# Altium schematic sheet LevelShifter.SchDoc
size A; SheetNumber: 4; SheetTotal: 6
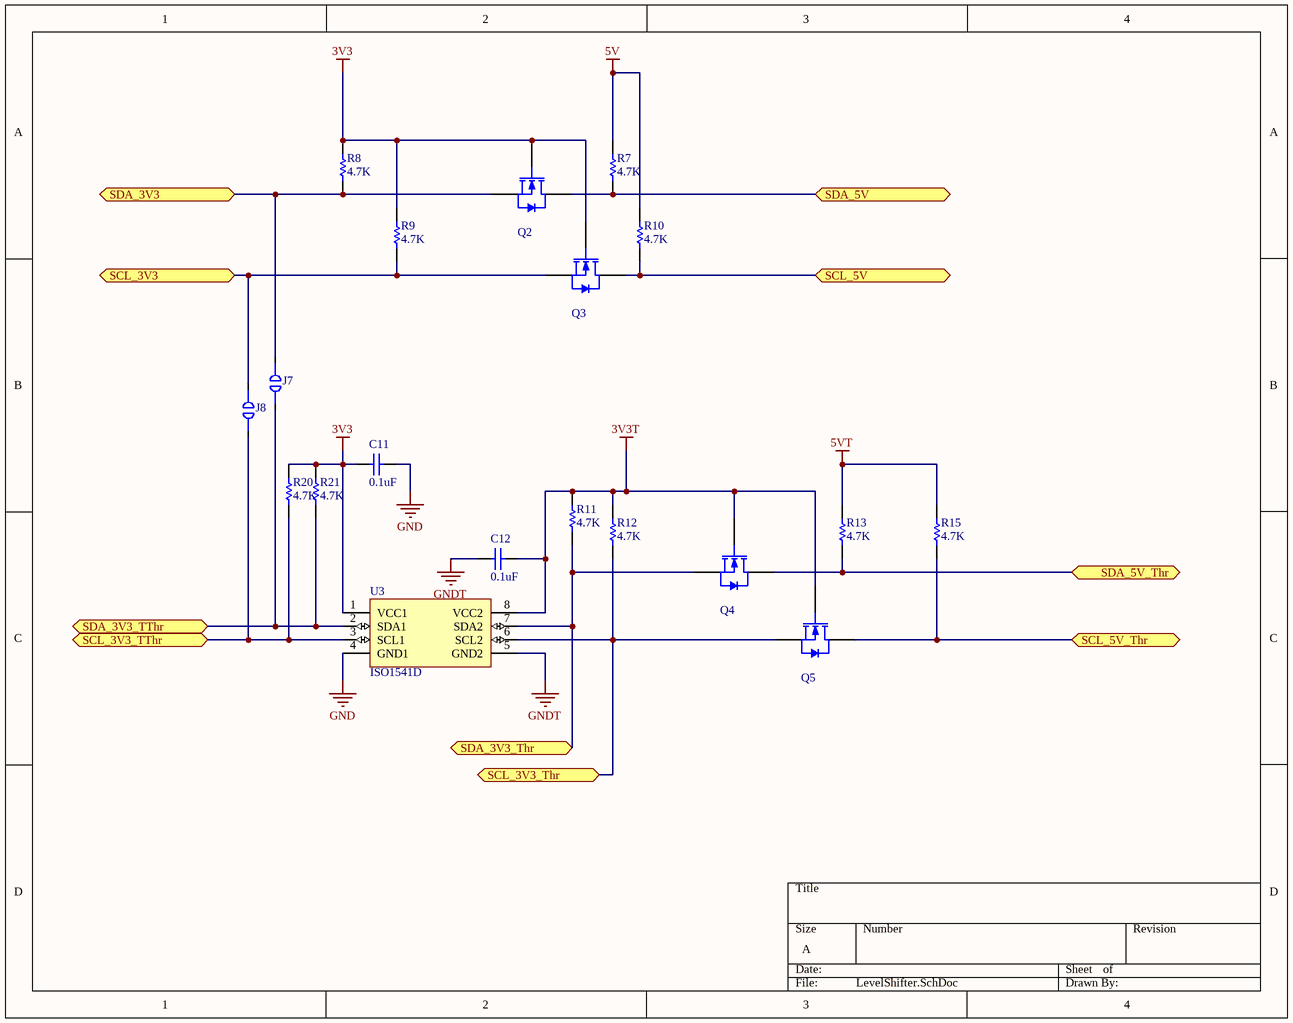
[diagram p0: LevelShifter.SchDoc]

## Parts
C11  0.1uF  [CAPC1608X97X38NL12T08]
C12  0.1uF  [CAPC1608X97X38NL12T08]
J7  Solder Jumper  [SolderJumper]  (value not drawn)
J8  Solder Jumper  [SolderJumper]  (value not drawn)
Q2  MOSFET N-CH  [ONSC-SOT-23-3-318-08_V]  (value not drawn)
Q3  MOSFET N-CH  [ONSC-SOT-23-3-318-08_V]  (value not drawn)
Q4  MOSFET N-CH  [ONSC-SOT-23-3-318-08_V]  (value not drawn)
Q5  MOSFET N-CH  [ONSC-SOT-23-3-318-08_V]  (value not drawn)
R7  4.7K  [RESC1609X55X30NL10T20]
R8  4.7K  [RESC1609X55X30NL10T20]
R9  4.7K  [RESC1609X55X30NL10T20]
R10  4.7K  [RESC1609X55X30NL10T20]
R11  4.7K  [RESC1609X55X30NL10T20]
R12  4.7K  [RESC1609X55X30NL10T20]
R13  4.7K  [RESC1609X55X30NL10T20]
R15  4.7K  [RESC1609X55X30NL10T20]
R20  4.7K  [RESC1609X55X30NL10T20]
R21  4.7K  [RESC1609X55X30NL10T20]
U3  ISO1541D  [ISO1541D]

## Ports
SCL_3V3 (bidir), SCL_3V3_Thr (bidir), SCL_3V3_TThr (bidir), SCL_5V (bidir), SCL_5V_Thr (bidir), SDA_3V3 (bidir), SDA_3V3_Thr (bidir), SDA_3V3_TThr (bidir), SDA_5V (bidir), SDA_5V_Thr (bidir)

## Nets
3V3: C11.2 Q2.1(G) Q3.1(G) R8.2 R9.2 R20.2 R21.2 U3.1(VCC1)
3V3T: C12.1 Q4.1(G) Q5.1(G) R11.2 R12.2 U3.8(VCC2)
5V: R7.2 R10.2
5VT: R13.2 R15.2
GND: C11.1 U3.4(GND1)
GNDT: C12.2 U3.5(GND2)
SCL_3V3: J8.2 Q3.2(S) R9.1 ; port SCL_3V3
SCL_3V3_Thr: Q5.2(S) R12.1 U3.6(SCL2) ; port SCL_3V3_Thr
SCL_3V3_TThr: J8.1 R20.1 U3.3(SCL1) ; port SCL_3V3_TThr
SCL_5V: Q3.3(D) R10.1 ; port SCL_5V
SCL_5V_Thr: Q5.3(D) R15.1 ; port SCL_5V_Thr
SDA_3V3: J7.2 Q2.2(S) R8.1 ; port SDA_3V3
SDA_3V3_Thr: Q4.2(S) R11.1 U3.7(SDA2) ; port SDA_3V3_Thr
SDA_3V3_TThr: J7.1 R21.1 U3.2(SDA1) ; port SDA_3V3_TThr
SDA_5V: Q2.3(D) R7.1 ; port SDA_5V
SDA_5V_Thr: Q4.3(D) R13.1 ; port SDA_5V_Thr

## Library data of the parts
C11 C12 = VJ0603Y104KXXAC: CAP CER 0.1UF 25V X7R 0603; Manufacturer: Vitramon; Part Number: VJ0603Y-104KXXAC; Supplier 1: Digi-Key; Supplier Part Number 1: 720-1378-1-ND
J7 J8 = Solder Jumper: Simple Jumper
Q2-Q5 = BSS138LT1G: MOSFET N-CH 50V 200MA SOT-23; Manufacturer 1: ON Semiconductor; Rds On Max: 3.5R; Max Power Dissipation: 225mW; Input Capacitance: 50pF; Turn-Off Delay Time: 20ns; Gate to Source Voltage (Vgs): 20V; Number of Elements: 1; Element Configuration: Single; Threshold Voltage: 1.5V; Supplier 1: Digi-Key; Supplier Part Number 1: BSS138LT1GOSCT-ND; Manufacturer Part Number 1: BSS138LT1G; Stock 1: 952638; Pricing 1: 1=0.26000, 10=0.21100, 100=0.11210, 500=0.07376, 1000=0.05016 (USD); RoHS: Yes; Case/Package: SOT-23-3; Number of Pins: 3; Contact Plating: Tin,Matte; Min Operating Temperature: -55°C; Max Operating Temperature: 150°C; Packaging: Tape and Reel; Continuous Drain Current (ID): 200mA; Drain to Source Resistance: 3.5R; Package Quantity: 1; Drain to Source Breakdown Voltage: 50V; Power Dissipation: 225mW; Turn-On Delay Time: 20ns; Nominal Vgs: 1.5V; Voltage Rating (DC): 50V; Current Rating: 200mA; On-State Resistance: 3.5R; Length: 3.04mm; Height: 1.01mm; Width: 1.4mm; Radiation Hardening: No; Lead Free: Lead Free; REACH SVHC: No SVHC; Halogen Free: Halogen Free; ComponentLink1URL: https://datasheet.ciiva.com/22641/1596366-22641636.pdf?src-supplier=Element14; ComponentLink1Description: https://datasheet.ciiva.com/22641/1596366-22641636.pdf?src-supplier=Element14; ComponentLink2URL: https://datasheet.ciiva.com/936/bss138lt1-d-936801.pdf?src-supplier=Digi-Key; ComponentLink2Description: https://datasheet.ciiva.com/936/bss138lt1-d-936801.pdf?src-supplier=Digi-Key; ComponentLink3URL: https://datasheet.ciiva.com/936/bss138lt1-d-936802.pdf?src-supplier=Digi-Key; ComponentLink3Description: https://datasheet.ciiva.com/936/bss138lt1-d-936802.pdf?src-supplier=Digi-Key; ComponentLink4URL: https://datasheet.ciiva.com/936/bss138lt1-d-936803.pdf?src-supplier=Digi-Key; ComponentLink4Description: https://datasheet.ciiva.com/936/bss138lt1-d-936803.pdf?src-supplier=Digi-Key; ComponentLink5URL: https://datasheet.ciiva.com/14553/70099493-14553829.pdf?src-supplier=Allied+Electronics; ComponentLink5Description: https://datasheet.ciiva.com/14553/70099493-14553829.pdf?src-supplier=Allied+Electronics; ComponentLink6URL: https://datasheet.ciiva.com/1190/1596366-1190136.pdf?src-supplier=Element14; ComponentLink6Description: https://datasheet.ciiva.com/1190/1596366-1190136.pdf?src-supplier=Element14; ComponentLink7URL: https://datasheet.ciiva.com/1190/1596366-1190137.pdf?src-supplier=Element14; ComponentLink7Description: https://datasheet.ciiva.com/1190/1596366-1190137.pdf?src-supplier=Element14; ComponentLink8URL: https://datasheet.ciiva.com/15198/getdatasheetpartid-110266-15198908.pdf?src-supplier=Verical; ComponentLink8Description: https://datasheet.ciiva.com/15198/getdatasheetpartid-110266-15198908.pdf?src-supplier=Verical; ComponentLink9URL: https://datasheet.ciiva.com/8115/bss138lt1-d-8115358.pdf?src-supplier=Avnet; ComponentLink9Description: https://datasheet.ciiva.com/8115/bss138lt1-d-8115358.pdf?src-supplier=Avnet; ComponentLink10URL: https://datasheet.ciiva.com/8115/bss138lt1-d-8115295.pdf?src-supplier=Avnet; ComponentLink10Description: https://datasheet.ciiva.com/8115/bss138lt1-d-8115295.pdf?src-supplier=Avnet
R7-R13 R15 R20 R21 = TNPW06034K70BEEN: RES 4.7K  OHM 0.1% 1/8W 0603; Manufacturer 1: Vishay; Manufacturer Part Number 1: TNPW06032K20BYEN; Resistance: 2.2kR; Temperature Coefficient: 10ppm/°C; Power Rating: 100mW; Stock 1: 1000; Pricing 1: 1=0.88000, 10=0.76200, 100=0.53130 (USD); RoHS: Yes; Mount: Surface Mount; Case/Package: 0603; Contact Plating: Tin; Min Operating Temperature: -55°C; Max Operating Temperature: 125°C; Tolerance: 0.1%; Composition: Thin Film; Packaging: Tape and Reel; Military Standard: Not; Length: 1.6mm; Height: 0.45mm; Depth: 0.85mm; Radiation Hardening: No; ComponentLink1URL: https://datasheet.ciiva.com/11821/0900766b80d9a43d-11821758.pdf?src-supplier=RSComponents; ComponentLink1Description: https://datasheet.ciiva.com/11821/0900766b80d9a43d-11821758.pdf?src-supplier=RSComponents; ComponentLink2URL: https://datasheet.ciiva.com/17202/tnpw-e3-17202093.pdf?src-supplier=Avnet+Europe; ComponentLink2Description: https://datasheet.ciiva.com/17202/tnpw-e3-17202093.pdf?src-supplier=Avnet+Europe; Supplier 1: Digi-Key; Supplier Part Number 1: 541-3689-1-ND
U3 = ISO1541D: I²C Digital Isolator 2500Vrms 2 Channel 1Mbps 25kV/µs CMTI 8-SOIC (0.154", 3.90mm Width) /; Manufacturer: Texas Instruments; Manufacturer Part Number 1: ISO1540DR; Number of Channels: 2; Min Supply Voltage: 3V; Max Supply Voltage: 5.5V; Nominal Supply Current: 3.6mA; Channel Type: Bidirectional; Propagation Delay: 70ns; Isolated Power: No; Pulse Width Distortion (PWD): 21ns; Working Voltage: 566V; RoHS: Yes; Category: Interface ICs; Stock 1: 11170; Pricing: 1=4.51000, 10=4.04600, 25=3.82520, 100=3.14500, 250=2.82200, 500=2.72000, 1000=2.26100 (USD); Mount: Surface Mount; Case/Package: SOIC; Number of Pins: 8; Min Operating Temperature: -40°C; Max Operating Temperature: 125°C; Data Rate: 1Mbps; Packaging: Tape and Reel; Package Quantity: 1; REACH SVHC: No SVHC; Lead Free: Lead Free; ComponentLink1URL: https://datasheet.ciiva.com/6579/iso1540-6579725.pdf?src-supplier=Digi-Key; ComponentLink1Description: https://datasheet.ciiva.com/6579/iso1540-6579725.pdf?src-supplier=Digi-Key; ComponentLink2URL: https://datasheet.ciiva.com/6579/iso1540-6579723.pdf?src-supplier=Digi-Key; ComponentLink2Description: https://datasheet.ciiva.com/6579/iso1540-6579723.pdf?src-supplier=Digi-Key; ComponentLink3URL: https://datasheet.ciiva.com/6579/iso1540-6579724.pdf?src-supplier=Digi-Key; ComponentLink3Description: https://datasheet.ciiva.com/6579/iso1540-6579724.pdf?src-supplier=Digi-Key; ComponentLink4URL: https://datasheet.ciiva.com/14196/iso1540-14196749.pdf?src-supplier=Avnet; ComponentLink4Description: https://datasheet.ciiva.com/14196/iso1540-14196749.pdf?src-supplier=Avnet; Supplier 1: Digi-Key; Supplier Part Number 1: 296-34895-5-ND